# Altium project DS132-1.0-B电导率传感器.PrjPCB
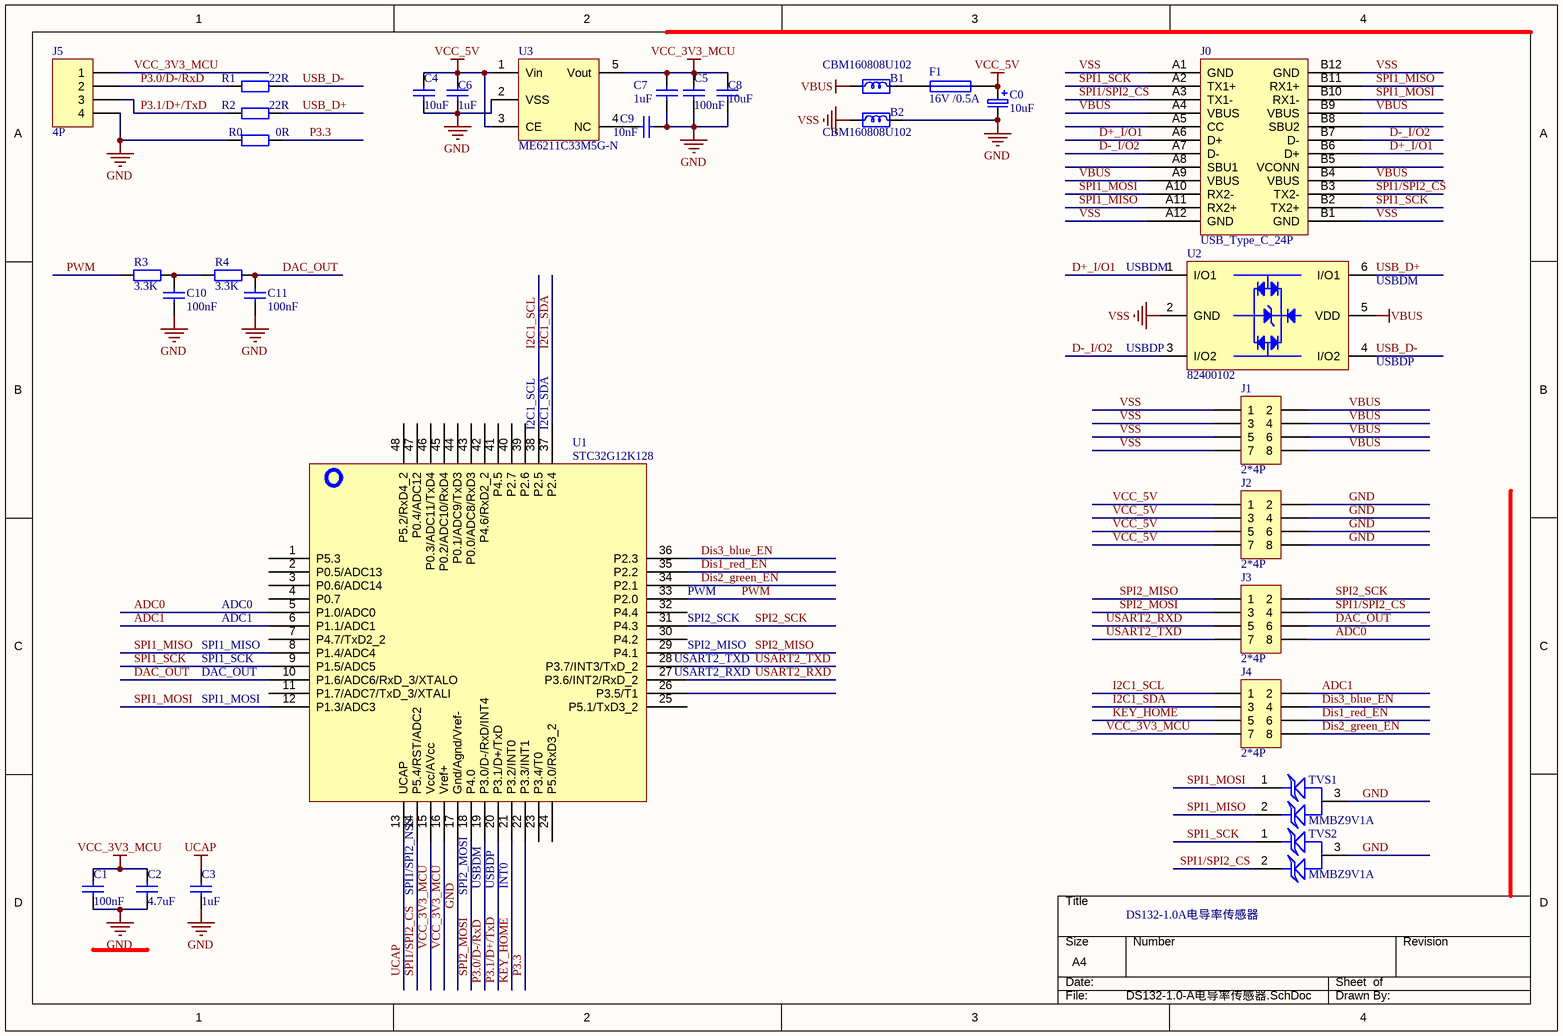
[diagram p0: DS132-1.0-A电导率传感器.SchDoc]
2 sheets, 97 parts. Net scope: global (net labels, ports and power ports of the same name join across sheets).
Board files: DS132-1.0-A电导率传感器.PcbDoc, DS132-1.0-B电导率传感器.PcbDoc
Sheets:
  DS132-1.0-A电导率传感器.SchDoc
  DS132-1.0-B电导率传感器.SchDoc

## Sheet DS132-1.0-A电导率传感器.SchDoc
size A4

### Parts
(Parts that share a designator on the sheet are numbered #1, #2 ... from top to bottom, then left to right.)
B1  CBM160808U102  [0603Bead]
B2  CBM160808U102  [0603Bead]
C0  value 10uF  [AVX_3216-18(1206)_SMD]  (hidden comment: AVX_10uF/16V ±10％(C106))
C1#1  value 100nF  [0603CAP]  (hidden comment: SMDCAP00013)
C2#1  value 4.7uF  [0603CAP]  (hidden comment: SMDCAP00012)
C3#1  value 1uF  [0603CAP]  (hidden comment: SMDCAP00015)
C4#1  value 10uF  [1206CAP]  (hidden comment: MLCC 10uF 50V ±20％ 1206)
C5#1  value 100nF  [0603CAP]  (hidden comment: SMDCAP00013)
C6#1  value 1uF  [0603CAP]  (hidden comment: SMDCAP00015)
C7#1  value 1uF  [0603CAP]  (hidden comment: SMDCAP00015)
C8#1  value 10uF  [1206CAP]  (hidden comment: MLCC 10uF 50V ±20％ 1206)
C9#1  value 10nF  [0603CAP]  (hidden comment: SMDCAP00010)
C10#1  value 100nF  [0603CAP]  (hidden comment: SMDCAP00013)
C11#1  value 100nF  [0603CAP]  (hidden comment: SMDCAP00013)
F1  value 16V /0.5A  [1206FUSE]  (hidden comment: SMD1206-050C-16V)
J0  USB_Type_C_24P  [USB_TYPE_C_24P_Receptacle]
J1#1  value 2*4P  [X1321FVS-2x04-C43D48]  (hidden comment: X1321FVS-2x04-C43D48)
J2#1  value 2*4P  [X1321FVS-2x04-C43D48]  (hidden comment: X1321FVS-2x04-C43D48)
J3#1  value 2*4P  [X1321FVS-2x04-C43D48]  (hidden comment: X1321FVS-2x04-C43D48)
J4#1  value 2*4P  [X1321FVS-2x04-C43D48]  (hidden comment: X1321FVS-2x04-C43D48)
J5#1  value 4P  [H4]  (hidden comment: DIP4单排直针  间距2mm 针长11mm 铜)
R0  value 0R  [0603RES]  (hidden comment: Chip 0R 1/16W ±1％ 0603)
R1  value 22R  [0603RES]  (hidden comment: Chip 22R 1/16W ±1％ 0603)
R2#1  value 22R  [0603RES]  (hidden comment: Chip 22R 1/16W ±1％ 0603)
R3#1  value 3.3K  [0603RES]  (hidden comment: SMDRES00090)
R4#1  value 3.3K  [0603RES]  (hidden comment: SMDRES00090)
TVS1  MMBZ9V1A  [SOT23]
TVS2  MMBZ9V1A  [SOT23]
U1#1  value STC32G12K128  [LQFP-48]  (hidden comment: STC32G12K128_35I LQFP48)
U2#1  82400102  [SOT23-6]
U3#1  ME6211C33M5G-N  [SOT23-5]

### Nets
GND: B2.2 C0.2 C1#1.1 C2#1.1 C3#1.1 C4#1.1 C5#1.1 C6#1.1 C7#1.1 C8#1.1 C9#1.2 C10#1.1 C11#1.1 J2#1.2 J2#1.4 J2#1.6 J2#1.8 J5#1.4 R0.1 TVS1.3 TVS2.3 U1#1.17(Gnd/Agnd/Vref-) U3#1.2(VSS)
UCAP: C3#1.2 U1#1.13(UCAP)
VBUS: B1.1 J0.A4(VBUS) J0.A9(VBUS) J0.B4(VBUS) J0.B9(VBUS) J1#1.2 J1#1.4 J1#1.6 J1#1.8 U2#1.5(VDD)
VCC_3V3_MCU: C1#1.2 C2#1.2 C5#1.2 C7#1.2 C8#1.2 J4#1.7 J5#1.1 U1#1.15(Vcc/AVcc) U1#1.16(Vref+) U3#1.5(Vout)
VCC_5V: C0.1 C4#1.2 C6#1.2 F1.2 J2#1.1 J2#1.3 J2#1.5 J2#1.7 U3#1.1(Vin) U3#1.3(CE)
VSS: B2.1 J0.A1(GND) J0.A12(GND) J0.B1(GND) J0.B12(GND) J1#1.1 J1#1.3 J1#1.5 J1#1.7 U2#1.2(GND)
ADC0: J3#1.8 U1#1.5(P1.0/ADC0)
ADC1: J4#1.2 U1#1.6(P1.1/ADC1)
D+_I/O1: J0.A6(D+) J0.B6(D+) U2#1.1(I/O1)
D-_I/O2: J0.A7(D-) J0.B7(D-) U2#1.3(I/O2)
DAC_OUT: C11#1.2 J3#1.6 R4#1.2 U1#1.10(P1.6/ADC6/RxD_3/XTALO)
Dis1_red_EN: J4#1.6 U1#1.35(P2.2)
Dis2_green_EN: J4#1.8 U1#1.34(P2.1)
Dis3_blue_EN: J4#1.4 U1#1.36(P2.3)
I2C1_SCL: J4#1.1 U1#1.38(P2.5)
I2C1_SDA: J4#1.3 U1#1.37(P2.4)
KEY_HOME: J4#1.5 U1#1.21(P3.2/INT0)
P3.0/D-/RxD: J5#1.2 R1.1 U1#1.19(P3.0/D-/RxD/INT4)
P3.1/D+/TxD: J5#1.3 R2#1.1 U1#1.20(P3.1/D+/TxD)
P3.3: R0.2 U1#1.22(P3.3/INT1)
PWM: R3#1.1 U1#1.33(P2.0)
SPI1/SPI2_CS: J0.A3(TX1-) J0.B3(TX2-) J3#1.4 TVS2.2 U1#1.14(P5.4/RST/ADC2)
SPI1_MISO: J0.A11(RX2+) J0.B11(RX1+) TVS1.2 U1#1.8(P1.4/ADC4)
SPI1_MOSI: J0.A10(RX2-) J0.B10(RX1-) TVS1.1 U1#1.12(P1.3/ADC3)
SPI1_SCK: J0.A2(TX1+) J0.B2(TX2+) TVS2.1 U1#1.9(P1.5/ADC5)
SPI2_MISO: J3#1.1 U1#1.29(P4.1)
SPI2_MOSI: J3#1.3 U1#1.18(P4.0)
SPI2_SCK: J3#1.2 U1#1.31(P4.3)
USART2_RXD: J3#1.5 U1#1.27(P3.6/INT2/RxD_2)
USART2_TXD: J3#1.7 U1#1.28(P3.7/INT3/TxD_2)
USB_D+: R2#1.2 U2#1.6(I/O1)
USB_D-: R1.2 U2#1.4(I/O2)
NetB1_2: B1.2 F1.1
NetC9#1_1: C9#1.1 U3#1.4(NC)
NetC10#1_2: C10#1.2 R3#1.2 R4#1.1

Not connected (* = marked no-connect by the designer): J0 A5(CC) A8(SBU1) B5(VCONN) B8(SBU2); U1#1 1(P5.3) 2(P0.5/ADC13) 3(P0.6/ADC14) 4(P0.7) 7(P4.7/TxD2_2) 11(P1.7/ADC7/TxD_3/XTALI) 23(P3.4/T0) 24(P5.0/RxD3_2) 25(P5.1/TxD3_2) 26(P3.5/T1) 30(P4.2) 32(P4.4) 39(P2.6) 40(P2.7) 41(P4.5) 42(P4.6/RxD2_2) 43(P0.0/ADC8/RxD3) 44(P0.1/ADC9/TxD3) 45(P0.2/ADC10/RxD4) 46(P0.3/ADC11/TxD4) 47(P0.4/ADC12) 48(P5.2/RxD4_2)

### Notes on the sheet
- (near U2#1) USBDM
- (near U2#1) USBDP
- (near U1#1) I2C1_SCL
- (near U1#1) I2C1_SDA
- (near U1#1) SPI1_MISO
- ADC0
- ADC1
- (near U1#1) SPI2_MISO
- (near U1#1) SPI2_SCK
- (near U1#1) PWM
- (near U1#1) SPI1_MOSI
- SPI1_SCK
- DAC_OUT
- (near U1#1) USART2_TXD
- (near U1#1) USART2_RXD
- (near U1#1) SPI1/SPI2_NSS
- (near U1#1) SPI2_MOSI
- USBDM
- USBDP
- INT0
- DS132-1.0A电导率传感器
- DWG. NO.
- REV.
- SHT.
- THIS DOCUMENT AND THE DATA DISCLOSED HEREIN OR HEREWITH IS THE PROPERTY OF ALTIUM LIMITED AND MAY BE FREELY DISTRIBUTED IN WHOLE. NO RIGHTS ARE RESERVED OR EXPRESS OR IMPLIED WARANTEE GIVEN.
- REVISION
- DESCRIPTION
- DATE
- APPROVED
- ENG:
- APPROVALS
- PROJECT
- DSN:
- CHK:
- REFERENCE DOCUMENTS
- PROJECT REVISION:
- TITLE
- DOCUMENT REVISION:
- DESIGN ITEM:
- BOM:
- FAB DWG:
- PCB DWG:
- ASSY DWG:
- SCALE:
- SIZE
- B
- CAGE CODE
- FILE NAME
- DWG NO.
- SHEET
- OF
- REV

### Library data of the parts
B1 B2 = Chip Ferrite Bead 0606: 贴片磁珠
C0 = AVX_10uF/16V ±10％(C106): 钽电容
C1#1 C5#1 C10#1 C11#1 = MLCC 100nF 50V ±10％ 0603: 贴片电容
C2#1 = MLCC 4.7uF 50V ±10％ 0603: 贴片电容
C3#1 C6#1 C7#1 = MLCC 1uF 50V ±10％ 0603: 贴片电容
C4#1 C8#1 = MLCC 10uF 50V ±20％ 1206: 贴片电容
C9#1 = MLCC 10nF 50V ±10％ 0603: 贴片电容
F1 = SMD1206-050C-16V: 贴片自恢复保险丝 16V /0.5A
J1#1 J2#1 J3#1 J4#1 = X1321FVS-2x04-C43D48: 双排母2x4P 立贴 1.27mm
J5#1 = DIP4单排直针  间距2mm 针长11mm 铜: 单排直针
R0 = Chip 0R 1/16W ±1％ 0603: 贴片电阻
R1 R2#1 = Chip 22R 1/16W ±1％ 0603: 贴片电阻
R3#1 R4#1 = Chip 3.3K 1/16W ±1％ 0603: 贴片电阻
TVS1 TVS2 = TVS: 瞬态抑制二极管
U1#1 = STC32G12K128_35I LQFP48: 单片机芯片
U2#1 = 82400102: 瞬态抑制二极管(TVS)
U3#1 = ME6211C33M5G-N: 稳压芯片

## Sheet DS132-1.0-B电导率传感器.SchDoc
size A3
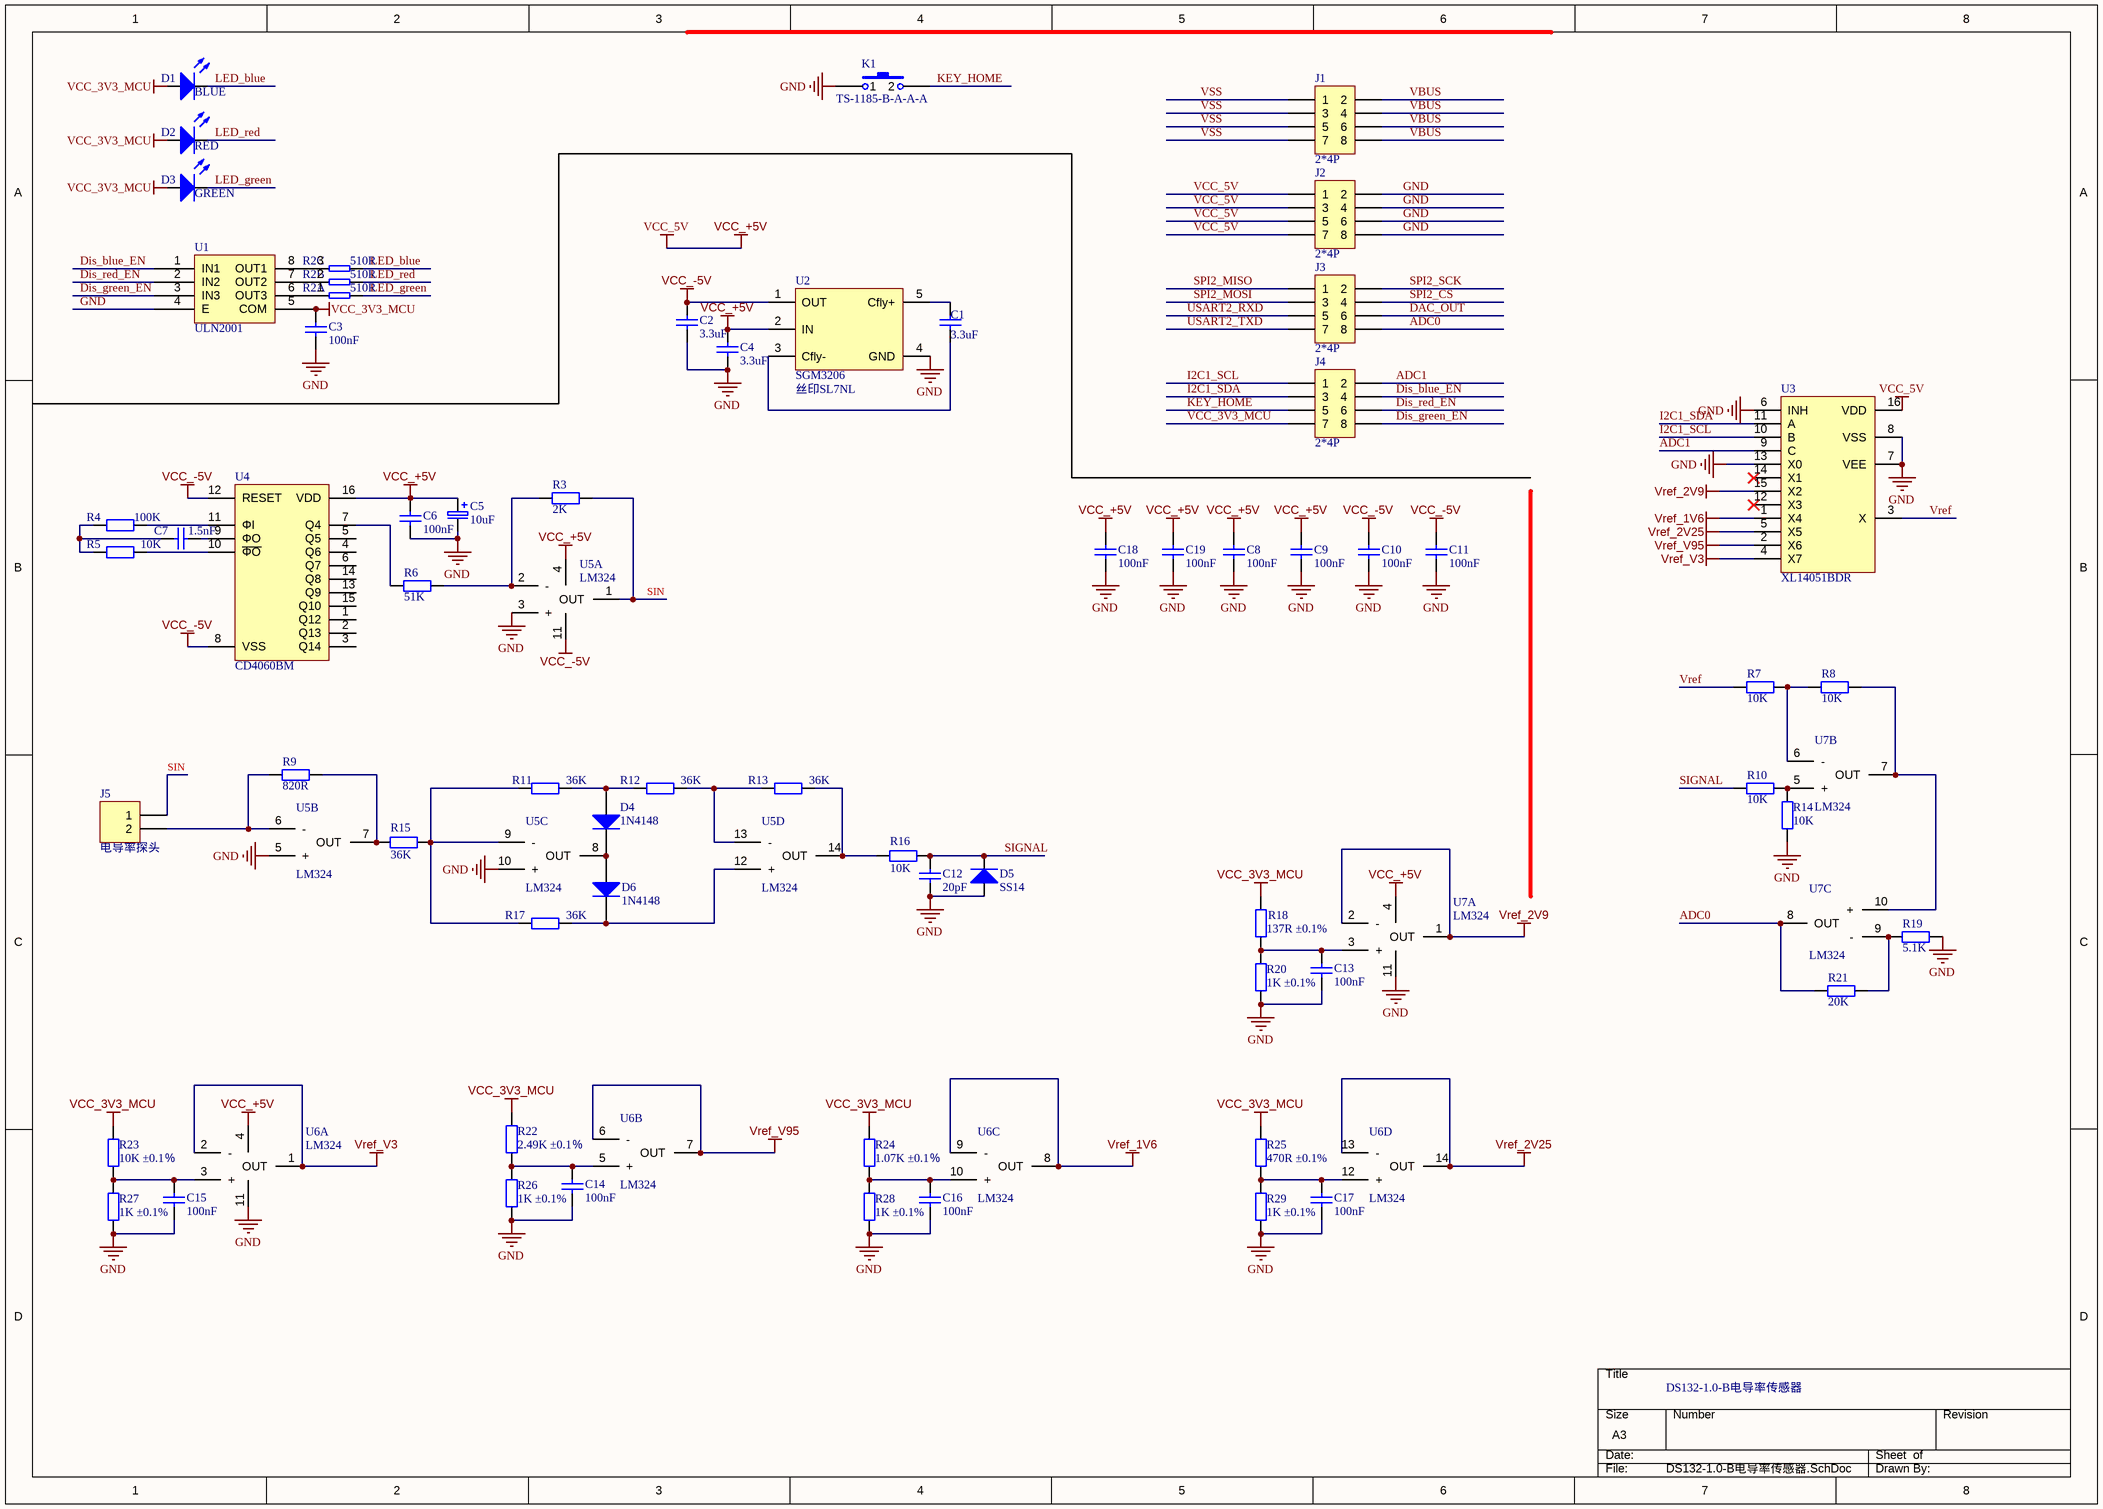
[diagram p1: DS132-1.0-B电导率传感器.SchDoc]

### Parts
(Parts that share a designator on the sheet are numbered #1, #2 ... from top to bottom, then left to right.)
C1#2  value 3.3uF  [0603CAP]  (hidden comment: SMDCAP00016)
C2#2  value 3.3uF  [0603CAP]  (hidden comment: SMDCAP00016)
C3#2  value 100nF  [0603CAP]
C4#2  value 3.3uF  [0603CAP]  (hidden comment: SMDCAP00016)
C5#2  value 10uF  [AVX_3216-18(1206)_SMD]  (hidden comment: AVX_10uF/16V ±10％(C106))
C6#2  value 100nF  [0603CAP]  (hidden comment: SMDCAP00013)
C7#2  value 1.5nF  [0603CAP]  (hidden comment: MLCC 1.5nF 50V ±20％ 1206)
C8#2  value 100nF  [0603CAP]
C9#2  value 100nF  [0603CAP]
C10#2  value 100nF  [0603CAP]
C11#2  value 100nF  [0603CAP]
C12  value 20pF  [0603CAP]  (hidden comment: MLCC 20pF 50V ±10％ 1206)
C13  value 100nF  [0603CAP]
C14  value 100nF  [0603CAP]
C15  value 100nF  [0603CAP]
C16  value 100nF  [0603CAP]
C17  value 100nF  [0603CAP]
C18  value 100nF  [0603CAP]
C19  value 100nF  [0603CAP]
D1  value BLUE  [LED_0805]  (hidden comment: SMDLED00010)
D2  value RED  [LED_0805]  (hidden comment: SMDLED00003)
D3  value GREEN  [LED_0805]  (hidden comment: Chip 翠绿LED 0805)
D4  value 1N4148  [SOD-123]  (hidden comment: DIPDIODE02001)
D5  value SS14  [SMA/DO-214AC]  (hidden comment: SMDDIODE06003)
D6  value 1N4148  [SOD-123]  (hidden comment: DIPDIODE02001)
J1#2  value 2*4P  [X1321WVS-2x04J-C40D53]  (hidden comment: X1321WVS-2x04J-C40D53)
J2#2  value 2*4P  [X1321WVS-2x04J-C40D53]  (hidden comment: X1321WVS-2x04J-C40D53)
J3#2  value 2*4P  [X1321WVS-2x04J-C40D53]  (hidden comment: X1321WVS-2x04J-C40D53)
J4#2  value 2*4P  [X1321WVS-2x04J-C40D53]  (hidden comment: X1321WVS-2x04J-C40D53)
J5#2  value 电导率探头  [SIP2]  (hidden comment: SL000000042)
K1  TS-1185-B-A-A-A  [KEY_TS-1185-x-A-A-A]
R2#2  value 510R  [0603RES_Pack4]  (hidden comment: SMDRES05003)  (parts A,B,C of 4)
R3#2  value 2K  [0603RES]  (hidden comment: SMDRES00042)
R4#2  value 100K  [0603RES]  (hidden comment: SMDRES00071)
R5  value 10K  [0603RES]  (hidden comment: SMDRES00056)
R6  value 51K  [0603RES]  (hidden comment: Chip 51K 1/16W ±1％ 0603)
R7  value 10K  [0603RES]  (hidden comment: SMDRES00056)
R8  value 10K  [0603RES]  (hidden comment: SMDRES00056)
R9  value 820R  [0603RES]  (hidden comment: Chip 820R 1/16W ±1％ 0603)
R10  value 10K  [0603RES]  (hidden comment: SMDRES00056)
R11  value 36K  [0603RES]  (hidden comment: SMDRES00062)
R12  value 36K  [0603RES]  (hidden comment: SMDRES00062)
R13  value 36K  [0603RES]  (hidden comment: SMDRES00062)
R14  value 10K  [0603RES]  (hidden comment: SMDRES00056)
R15  value 36K  [0603RES]  (hidden comment: SMDRES00062)
R16  value 10K  [0603RES]  (hidden comment: SMDRES00056)
R17  value 36K  [0603RES]  (hidden comment: SMDRES00062)
R18  value 137R ±0.1%  [0603RES]  (hidden comment: Chip 0R 1/16W ±1％ 0603)
R19  value 5.1K  [0603RES]  (hidden comment: SMDRES00049)
R20  value 1K ±0.1%  [0603RES]  (hidden comment: Chip 10K 1/16W ±0.1％ 0603)
R21  value 20K  [0603RES]  (hidden comment: SMDRES00058)
R22  value 2.49K ±0.1％  [0603RES]  (hidden comment: Chip 0R 1/16W ±1％ 0603)
R23  value 10K ±0.1％  [0603RES]
R24  value 1.07K ±0.1％  [0603RES]  (hidden comment: Chip 0R 1/16W ±1％ 0603)
R25  value 470R ±0.1%  [0603RES]  (hidden comment: Chip 0R 1/16W ±1％ 0603)
R26  value 1K ±0.1%  [0603RES]  (hidden comment: Chip 10K 1/16W ±0.1％ 0603)
R27  value 1K ±0.1%  [0603RES]  (hidden comment: Chip 10K 1/16W ±0.1％ 0603)
R28  value 1K ±0.1%  [0603RES]  (hidden comment: Chip 10K 1/16W ±0.1％ 0603)
R29  value 1K ±0.1%  [0603RES]  (hidden comment: Chip 10K 1/16W ±0.1％ 0603)
U1#2  value ULN2001  [SO-8]  (hidden comment: SMDIC000018)
U2#2  SGM3206  value 丝印SL7NL  [SOT23-5]
U3#2  XL14051BDR  [SOP-16]
U4  CD4060BM  [SOP-16]
U5  value LM324  [SO-14]  (hidden comment: SMDIC000032)  (parts A,B,C,D of 4)
U6  value LM324  [SO-14]  (hidden comment: SMDIC000032)  (parts A,B,C,D of 4)
U7  value LM324  [SO-14]  (hidden comment: SMDIC000032)  (parts A,B,C of 4)

### Nets
GND: C2#2.2 C3#2.1 C4#2.2 C5#2.2 C6#2.2 C8#2.1 C9#2.1 C10#2.1 C11#2.1 C12.2 C13.2 C14.2 C15.2 C16.2 C17.2 C18.1 C19.1 D5.1(A) J2#2.2 J2#2.4 J2#2.6 J2#2.8 K1.1 R14.1 R19.2 R20.1 R26.1 R27.1 R28.1 R29.1 U1#2.4(E) U2#2.4(GND) U3#2.6(INH) U3#2.7(VEE) U3#2.8(VSS) U3#2.13(X0) U5.3(+) U5.5(+) U5.10(+) U6.11(GND) U7.11(GND)
Hidden Net Name: R11.1(SIGNAL) R11.2(COMP) R11.3(VOUT) R11.4(VSS) R11.5(DEM) R11.6(VIN) R11.7(PCOMP) R11.8(VDD) R12.1(SIGNAL) R12.2(COMP) R12.3(VOUT) R12.4(VSS) R12.5(DEM) R12.6(VIN) R12.7(PCOMP) R12.8(VDD) R13.1(SIGNAL) R13.2(COMP) R13.3(VOUT) R13.4(VSS) R13.5(DEM) R13.6(VIN) R13.7(PCOMP) R13.8(VDD) R15.1(SIGNAL) R15.2(COMP) R15.3(VOUT) R15.4(VSS) R15.5(DEM) R15.6(VIN) R15.7(PCOMP) R15.8(VDD) R17.1(SIGNAL) R17.2(COMP) R17.3(VOUT) R17.4(VSS) R17.5(DEM) R17.6(VIN) R17.7(PCOMP) R17.8(VDD) R19.1(SIGNAL) R19.2(COMP) R19.3(VOUT) R19.4(VSS) R19.5(DEM) R19.6(VIN) R19.7(PCOMP) R19.8(VDD)
VBUS: J1#2.2 J1#2.4 J1#2.6 J1#2.8
VCC_3V3_MCU: C3#2.2 D1.1(A) D2.1(A) D3.1(A) J4#2.7 R18.2 R22.2 R23.2 R24.2 R25.2 U1#2.5(COM)
VCC_5V: C4#2.1 C5#2.1 C6#2.1 C8#2.2 C9#2.2 C18.2 C19.2 J2#2.1 J2#2.3 J2#2.5 J2#2.7 U2#2.2(IN) U3#2.16(VDD) U4.16(VDD) U5.4(VCC) U6.4(VCC) U7.4(VCC)  [also labelled VCC_+5V]
VCC_-5V: C2#2.1 C10#2.2 C11#2.2 U2#2.1(OUT) U4.8(VSS) U4.12(RESET) U5.11(GND)
Vref_1V6: U3#2.1(X4) U6.8(OUT) U6.9(-)
Vref_2V9: U3#2.15(X2) U7.1(OUT) U7.2(-)
Vref_2V25: U3#2.5(X5) U6.13(-) U6.14(OUT)
Vref_V3: U3#2.4(X7) U6.1(OUT) U6.2(-)
Vref_V95: U3#2.2(X6) U6.6(-) U6.7(OUT)
VSS: J1#2.1 J1#2.3 J1#2.5 J1#2.7
ADC0: J3#2.8 R21.1 U7.8(OUT)
ADC1: J4#2.2 U3#2.9(C)
DAC_OUT: J3#2.6
Dis_blue_EN: J4#2.4 U1#2.1(IN1)
Dis_green_EN: J4#2.8 U1#2.3(IN3)
Dis_red_EN: J4#2.6 U1#2.2(IN2)
I2C1_SCL: J4#2.1 U3#2.10(B)
I2C1_SDA: J4#2.3 U3#2.11(A)
KEY_HOME: J4#2.5 K1.2
LED_blue: D1.2(K) R2#2.6
LED_green: D3.2(K) R2#2.8
LED_red: D2.2(K) R2#2.7
SIGNAL: C12.1 D5.2(K) R10.1 R16.2
SIN: J5#2.1 R3#2.2 U5.1(OUT)
SPI2_CS: J3#2.4
SPI2_MISO: J3#2.1
SPI2_MOSI: J3#2.3
SPI2_SCK: J3#2.2
USART2_RXD: J3#2.5
USART2_TXD: J3#2.7
Vref: R7.1 U3#2.3(X)
NetC1#2_1: C1#2.1 U2#2.3(Cfly-)
NetC1#2_2: C1#2.2 U2#2.5(Cfly+)
NetC7#2_1: C7#2.1 U4.9(ΦO)
NetC7#2_2: C7#2.2 R4#2.1 R5.1
NetC13_1: C13.1 R18.1 R20.2 U7.3(+)
NetC14_1: C14.1 R22.1 R26.2 U6.5(+)
NetC15_1: C15.1 R23.1 R27.2 U6.3(+)
NetC16_1: C16.1 R24.1 R28.2 U6.10(+)
NetC17_1: C17.1 R25.1 R29.2 U6.12(+)
NetD4_1: D4.1(A) R11.2 R12.1
NetD4_2: D4.2(K) D6.1(A) U5.8(OUT)
NetD6_2: D6.2(K) R17.2 U5.12(+)
NetJ5#2_2: J5#2.2 R9.2 U5.6(-)
NetR2#2_1: R2#2.1 U1#2.6(OUT3)
NetR2#2_2: R2#2.2 U1#2.7(OUT2)
NetR2#2_3: R2#2.3 U1#2.8(OUT1)
NetR3#2_1: R3#2.1 R6.2 U5.2(-)
NetR4#2_2: R4#2.2 U4.11(ΦI)
NetR5_2: R5.2 U4.10(~{ΦO})
NetR6_1: R6.1 U4.7(Q4)
NetR7_2: R7.2 R8.2 U7.6(-)
NetR8_1: R8.1 U7.7(OUT) U7.10(+)
NetR9_1: R9.1 R15.1 U5.7(OUT)
NetR10_2: R10.2 R14.2 U7.5(+)
NetR11_1: R11.1 R15.2 R17.1 U5.9(-)
NetR12_2: R12.2 R13.1 U5.13(-)
NetR13_2: R13.2 R16.1 U5.14(OUT)
NetR19_1: R19.1 R21.2 U7.9(-)

Not connected (* = marked no-connect by the designer): U3#2 12(X3)* 14(X1)*; U4 1(Q12) 2(Q13) 3(Q14) 4(Q6) 5(Q5) 6(Q7) 13(Q9) 14(Q8) 15(Q10)

### Notes on the sheet
- DS132-1.0-B电导率传感器
- DWG. NO.
- REV.
- SHT.
- THIS DOCUMENT AND THE DATA DISCLOSED HEREIN OR HEREWITH IS THE PROPERTY OF ALTIUM LIMITED AND MAY BE FREELY DISTRIBUTED IN WHOLE. NO RIGHTS ARE RESERVED OR EXPRESS OR IMPLIED WARANTEE GIVEN.
- REVISION
- DESCRIPTION
- DATE
- APPROVED
- ENG:
- APPROVALS
- PROJECT
- DSN:
- CHK:
- REFERENCE DOCUMENTS
- PROJECT REVISION:
- TITLE
- DOCUMENT REVISION:
- DESIGN ITEM:
- BOM:
- FAB DWG:
- PCB DWG:
- ASSY DWG:
- SCALE:
- SIZE
- B
- CAGE CODE
- FILE NAME
- DWG NO.
- SHEET
- OF
- REV

### Library data of the parts
C1#2 C2#2 C4#2 = MLCC 10uF 50V ±10％ 0603: 贴片电容
C3#2 C6#2 C8#2 C9#2 C10#2 C11#2 C13-C19 = MLCC 100nF 50V ±10％ 0603: 贴片电容
C5#2 = AVX_10uF/16V ±10％(C106): 钽电容
C7#2 C12 = MLCC 10uF 50V ±20％ 1206: 贴片电容
D1 = Chip 蓝色LED 0805: 贴片LED
D2 = Chip 红色LED 0805: 贴片LED
D3 = Chip 翠绿LED 0805: 贴片LED
D4 D6 = 1N4148W: 贴片开关二极管 T4
D5 = SS12 SMA/DO-214AC（1N5817）: 贴片肖特基二极管
J1#2 J2#2 J3#2 J4#2 = X1321WVS-2x04J-C40D53: 双排针2x4P 立贴 1.27mm
J5#2 = DIP2 单排直针 1*40P 间距2.54mm 针长11mm 铜: 单排直针
K1 = TS-1185-B-A-A-A: 轻触开关; Value: TS-1185-B-A-A-A
R2#2 = Chip R*4 510R 1/16W ±5％ 0603: 贴片排阻
R3#2 = Chip 2K 1/16W ±1％ 0603: 贴片电阻
R4#2 = Chip 100K 1/16W ±1％ 0603: 贴片电阻
R5 R7 R8 R10 R14 R16 R20 R26-R29 = Chip 10K 1/16W ±1％ 0603: 贴片电阻
R6 = Chip 51K 1/16W ±1％ 0603: 贴片电阻
R9 R18 R22-R25 = Chip 0R 1/16W ±1％ 0603: 贴片电阻
R11-R13 R15 R17 = Chip 36K 1/16W ±1％ 0603: 贴片电阻
R19 = Chip 5.1K 1/16W ±1％ 0603: 贴片电阻
R21 = Chip 20K 1/16W ±1％ 0603: 贴片电阻
U1#2 = ULN2001 SOP-8: 电机驱动芯片
U2#2 = SGM3206: 电荷泵芯片
U3#2 = XL14051BDR: 8通道模拟多路复用器
U4 = CD4060BM: 14 位二进制分频器/振荡器
U5-U7 = LM324 SOP-14 ST: 运放芯片

## Nets that join several sheets
GND: DS132-1.0-A电导率传感器 (23 pins), DS132-1.0-B电导率传感器 (41 pins)
VBUS: DS132-1.0-A电导率传感器 (10 pins), DS132-1.0-B电导率传感器 (J1#2.2 J1#2.4 J1#2.6 J1#2.8)
VCC_3V3_MCU: DS132-1.0-A电导率传感器 (10 pins), DS132-1.0-B电导率传感器 (11 pins)
VCC_5V: DS132-1.0-A电导率传感器 (10 pins), DS132-1.0-B电导率传感器 (17 pins)
VSS: DS132-1.0-A电导率传感器 (10 pins), DS132-1.0-B电导率传感器 (J1#2.1 J1#2.3 J1#2.5 J1#2.7)
ADC0: DS132-1.0-A电导率传感器 (J3#1.8 U1#1.5), DS132-1.0-B电导率传感器 (J3#2.8 R21.1 U7.8)
ADC1: DS132-1.0-A电导率传感器 (J4#1.2 U1#1.6), DS132-1.0-B电导率传感器 (J4#2.2 U3#2.9)
DAC_OUT: DS132-1.0-A电导率传感器 (C11#1.2 J3#1.6 R4#1.2 U1#1.10), DS132-1.0-B电导率传感器 (J3#2.6)
I2C1_SCL: DS132-1.0-A电导率传感器 (J4#1.1 U1#1.38), DS132-1.0-B电导率传感器 (J4#2.1 U3#2.10)
I2C1_SDA: DS132-1.0-A电导率传感器 (J4#1.3 U1#1.37), DS132-1.0-B电导率传感器 (J4#2.3 U3#2.11)
KEY_HOME: DS132-1.0-A电导率传感器 (J4#1.5 U1#1.21), DS132-1.0-B电导率传感器 (J4#2.5 K1.2)
SPI2_MISO: DS132-1.0-A电导率传感器 (J3#1.1 U1#1.29), DS132-1.0-B电导率传感器 (J3#2.1)
SPI2_MOSI: DS132-1.0-A电导率传感器 (J3#1.3 U1#1.18), DS132-1.0-B电导率传感器 (J3#2.3)
SPI2_SCK: DS132-1.0-A电导率传感器 (J3#1.2 U1#1.31), DS132-1.0-B电导率传感器 (J3#2.2)
USART2_RXD: DS132-1.0-A电导率传感器 (J3#1.5 U1#1.27), DS132-1.0-B电导率传感器 (J3#2.5)
USART2_TXD: DS132-1.0-A电导率传感器 (J3#1.7 U1#1.28), DS132-1.0-B电导率传感器 (J3#2.7)